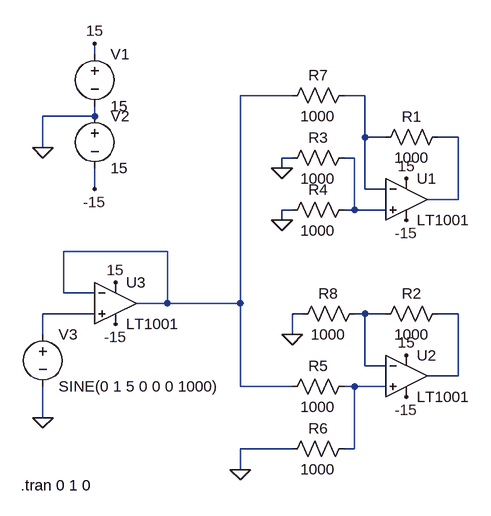
[diagram p0: schematic Diff_out_test.asc]
Diff_out_test.asc, the LTspice schematic file:
Version 4
SHEET 1 880 680
WIRE -304 -736 -304 -752
WIRE 0 -672 -80 -672
WIRE 112 -672 80 -672
WIRE -304 -640 -304 -656
WIRE -304 -640 -384 -640
WIRE 112 -608 112 -672
WIRE 144 -608 112 -608
WIRE 256 -608 224 -608
WIRE -384 -592 -384 -640
WIRE 0 -576 -16 -576
WIRE 96 -576 80 -576
WIRE -16 -560 -16 -576
WIRE -304 -528 -304 -560
WIRE 112 -528 112 -608
WIRE 144 -528 112 -528
WIRE 256 -512 256 -608
WIRE 256 -512 208 -512
WIRE 0 -496 -16 -496
WIRE 96 -496 96 -576
WIRE 96 -496 80 -496
WIRE 144 -496 96 -496
WIRE -16 -480 -16 -496
WIRE -192 -432 -352 -432
WIRE -352 -368 -352 -432
WIRE -304 -368 -352 -368
WIRE -192 -352 -192 -432
WIRE -192 -352 -240 -352
WIRE -80 -352 -80 -672
WIRE -80 -352 -192 -352
WIRE -304 -336 -384 -336
WIRE 16 -336 0 -336
WIRE 112 -336 96 -336
WIRE 144 -336 112 -336
WIRE 256 -336 224 -336
WIRE -384 -304 -384 -336
WIRE 0 -304 0 -336
WIRE 112 -256 112 -336
WIRE 144 -256 112 -256
WIRE 256 -240 256 -336
WIRE 256 -240 208 -240
WIRE -80 -224 -80 -352
WIRE 0 -224 -80 -224
WIRE 96 -224 80 -224
WIRE 144 -224 96 -224
WIRE -384 -176 -384 -224
WIRE 0 -128 -80 -128
WIRE 96 -128 96 -224
WIRE 96 -128 80 -128
WIRE -80 -96 -80 -128
FLAG -16 -560 0
FLAG -16 -480 0
FLAG -80 -96 0
FLAG 0 -304 0
FLAG -304 -752 15
FLAG -304 -528 -15
FLAG -384 -592 0
FLAG 176 -544 15
FLAG -272 -384 15
FLAG 176 -272 15
FLAG 176 -208 -15
FLAG -272 -320 -15
FLAG 176 -480 -15
FLAG -384 -176 0
SYMBOL OpAmps\\LT1001 176 -576 R0
SYMATTR InstName U1
SYMBOL OpAmps\\LT1001 176 -304 R0
SYMATTR InstName U2
SYMBOL res 240 -624 R90
WINDOW 0 0 56 VBottom 2
WINDOW 3 32 56 VTop 2
SYMATTR InstName R1
SYMATTR Value 1000
SYMBOL res 240 -352 R90
WINDOW 0 0 56 VBottom 2
WINDOW 3 32 56 VTop 2
SYMATTR InstName R2
SYMATTR Value 1000
SYMBOL res 96 -592 R90
WINDOW 0 0 56 VBottom 2
WINDOW 3 32 56 VTop 2
SYMATTR InstName R3
SYMATTR Value 1000
SYMBOL res 96 -512 R90
WINDOW 0 0 56 VBottom 2
WINDOW 3 32 56 VTop 2
SYMATTR InstName R4
SYMATTR Value 1000
SYMBOL res 96 -240 R90
WINDOW 0 0 56 VBottom 2
WINDOW 3 32 56 VTop 2
SYMATTR InstName R5
SYMATTR Value 1000
SYMBOL res 96 -144 R90
WINDOW 0 0 56 VBottom 2
WINDOW 3 32 56 VTop 2
SYMATTR InstName R6
SYMATTR Value 1000
SYMBOL res 96 -688 R90
WINDOW 0 0 56 VBottom 2
WINDOW 3 32 56 VTop 2
SYMATTR InstName R7
SYMATTR Value 1000
SYMBOL res 112 -352 R90
WINDOW 0 0 56 VBottom 2
WINDOW 3 32 56 VTop 2
SYMATTR InstName R8
SYMATTR Value 1000
SYMBOL OpAmps\\LT1001 -272 -416 R0
SYMATTR InstName U3
SYMBOL voltage -304 -752 R0
WINDOW 123 0 0 Left 0
WINDOW 39 0 0 Left 0
SYMATTR InstName V1
SYMATTR Value 15
SYMBOL voltage -304 -656 R0
WINDOW 123 0 0 Left 0
WINDOW 39 0 0 Left 0
SYMATTR InstName V2
SYMATTR Value 15
SYMBOL voltage -384 -320 R0
WINDOW 123 0 0 Left 0
WINDOW 39 0 0 Left 0
SYMATTR InstName V3
SYMATTR Value SINE(0 1 5 0 0 0 1000)
TEXT -418 -72 Left 2 !.tran 0 1 0

The netlist it stands for:
* Diff_out_test.asc
XU1 N004 N002 15 -15 N003 LT1001  ; pins In+ In- V+ V- OUT
XU2 N008 N006 15 -15 N007 LT1001  ; pins In+ In- V+ V- OUT
R1 N003 N002 1000
R2 N007 N006 1000
R3 N004 0 1000
R4 N004 0 1000
R5 N008 N001 1000
R6 N008 0 1000
R7 N002 N001 1000
R8 N006 0 1000
XU3 N005 N001 15 -15 N001 LT1001  ; pins In+ In- V+ V- OUT
V1 15 0 15
V2 0 -15 15
V3 N005 0 SINE(0 1 5 0 0 0 1000)
.tran 0 1 0
.lib LTC.lib
.backanno
.end